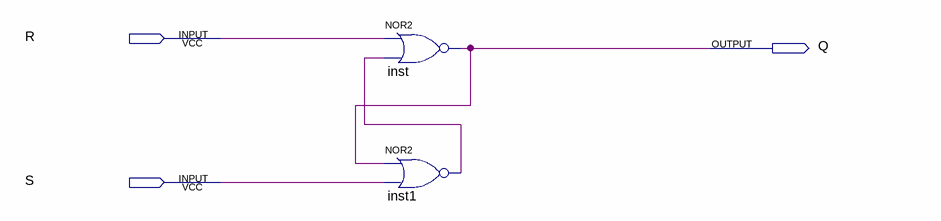
[diagram p0: schematic sheet]
// Quartus schematic mySRlatch.bdf as structural Verilog: 2 symbols, 3 pins
module mySRlatch (
  input  R,
  input  S,
  output Q
);

  wire inst1_out;

  nor inst (Q, R, inst1_out);
  nor inst1 (inst1_out, Q, S);
endmodule
